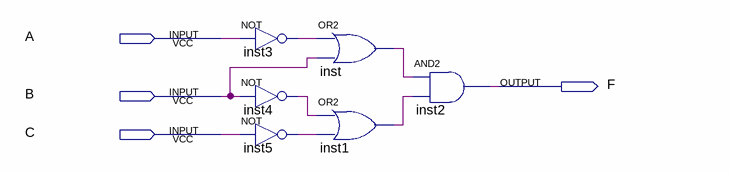
[diagram p0: schematic sheet]
// Quartus schematic main.bdf as structural Verilog: 6 symbols, 4 pins
module main (
  input  A,
  input  B,
  input  C,
  output F
);

  wire inst1_out, inst3_out, inst4_out, inst5_out, inst_out;

  not inst3 (inst3_out, A);
  not inst4 (inst4_out, B);
  not inst5 (inst5_out, C);
  or inst (inst_out, inst3_out, B);
  or inst1 (inst1_out, inst4_out, inst5_out);
  and inst2 (F, inst_out, inst1_out);
endmodule
